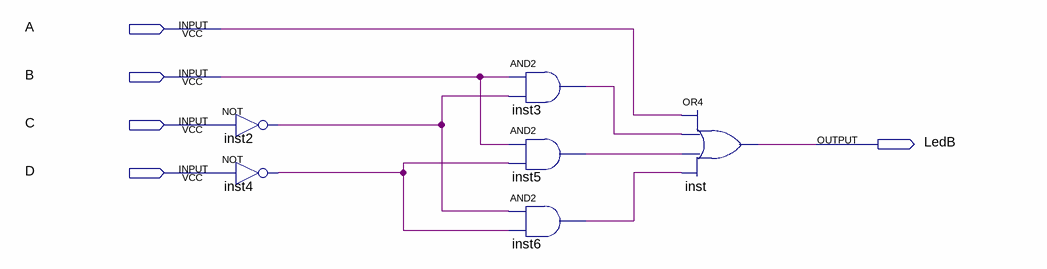
[diagram p0: schematic sheet]
// Quartus schematic LEDbcdB.bdf as structural Verilog: 6 symbols, 5 pins
module LEDbcdB (
  input  A,
  input  B,
  input  C,
  input  D,
  output LedB
);

  wire inst2_out, inst3_out, inst4_out, inst5_out, inst6_out;

  not inst2 (inst2_out, C);
  not inst4 (inst4_out, D);
  and inst3 (inst3_out, B, inst2_out);
  and inst5 (inst5_out, B, inst4_out);
  and inst6 (inst6_out, inst2_out, inst4_out);
  or inst (LedB, A, inst3_out, inst5_out, inst6_out);
endmodule
